# Altium schematic sheet Power Supply.SchDoc: =DocumentName
size A4; DocumentName: Power Supply
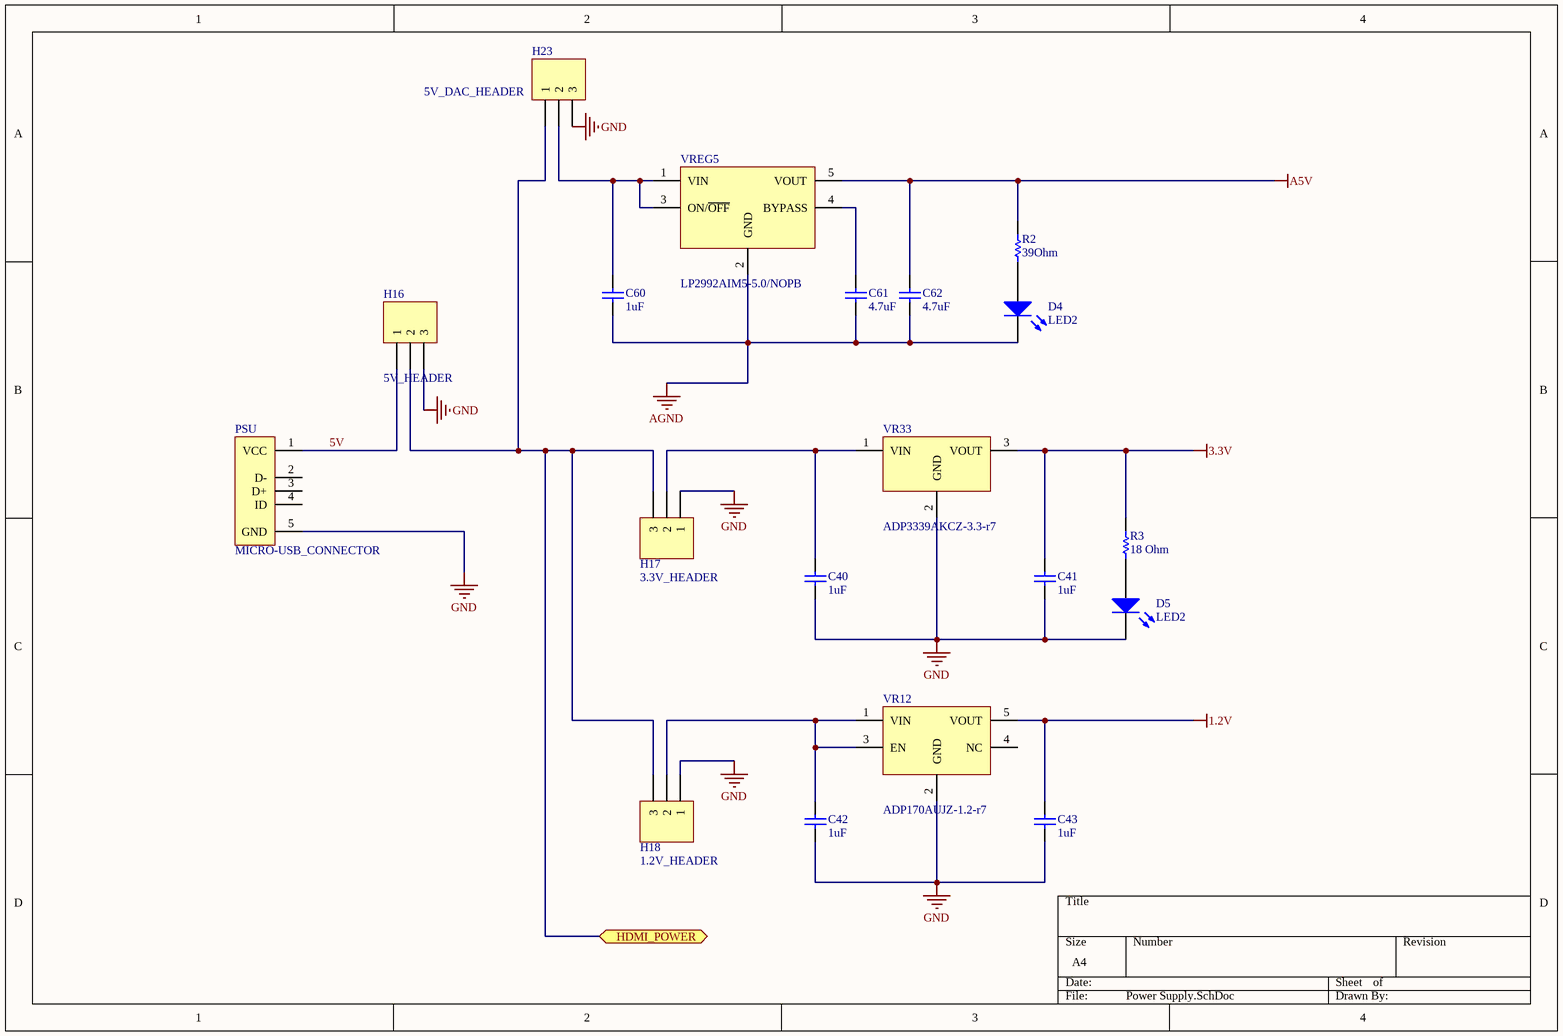
[diagram p0: Power Supply.SchDoc]

## Parts
C40  1uF  [CAPC0603(1608)100_M]
C41  1uF  [CAPC0603(1608)100_M]
C42  1uF  [CAPC0603(1608)100_M]
C43  1uF  [CAPC0603(1608)100_M]
C60  1uF  [CAPC0603(1608)100_M]
C61  4.7uF  [CAPC0603(1608)100_M]
C62  4.7uF  [CAPC0603(1608)100_M]
D4  LED2  [3.2X1.6X1.1]
D5  LED2  [3.2X1.6X1.1]
H16  5V_HEADER  [HDR1X3]
H17  3.3V_HEADER  [HDR1X3]
H18  1.2V_HEADER  [HDR1X3]
H23  5V_DAC_HEADER  [HDR1X3]
PSU  MICRO-USB_CONNECTOR  [MICRO-USB]
R2  39Ohm  [RESC0603(1608)_M]
R3  18 Ohm  [RESC0603(1608)_M]
VR12  ADP170AUJZ-1.2-r7  [VREG-1.2]
VR33  ADP3339AKCZ-3.3-r7  [VREG-3.3]
VREG5  LP2992AIM5-5.0/NOPB  [VREG-5]

## Ports
HDMI_POWER

## Nets
1.2V: C43.2 VR12.5(VOUT)
3.3V: C41.2 R3.2 VR33.3(VOUT)
A5V: C62.2 R2.2 VREG5.5(VOUT)
AGND: C60.1 C61.1 C62.1 D4.2(K) VREG5.2(GND)
GND: C40.1 C41.1 C42.1 C43.1 D5.2(K) H16.3 H17.1 H18.1 H23.3 PSU.5(GND) VR12.2(GND) VR33.2(GND)
5V: H16.1 PSU.1(VCC)
HDMI_POWER: H16.2 H17.3 H18.3 H23.1 ; port HDMI_POWER
NetC40_2: C40.2 H17.2 VR33.1(VIN)
NetC42_2: C42.2 H18.2 VR12.1(VIN) VR12.3(EN)
NetC60_2: C60.2 H23.2 VREG5.1(VIN) VREG5.3(ON/~{OFF})
NetC61_2: C61.2 VREG5.4(BYPASS)
NetD4_1: D4.1(A) R2.1
NetD5_1: D5.1(A) R3.1

Not connected (* = marked no-connect by the designer): PSU 2(D-) 3(D+) 4(ID); VR12 4(NC)

## Library data of the parts
C40-C43 C60-C62 = CMP-1035-00001-1: CAP 0.5pF 10V Â±0.1pF 0603 (1608 Metric) Thickness 1mm SMD; Case-EIA: 0603; Case-Metric: 1608; Max Thickness: 1 mm; Tolerance: Â±0.1pF; Technology: SMT; Rated Voltage: 10 V
  C40-C43 C60: Value: 1uF
  C61 C62: Value: 4.7uF
D4 D5 = LED2: Typical RED, GREEN, YELLOW, AMBER GaAs LED; Published: 8-Jun-2000; LatestRevisionDate: 17-Jul-2002; LatestRevisionNote: Re-released for DXP Platform.; PackageVersion: Feb-2002; PackageReference: 3.2X1.6X1.1; Publisher: Altium Limited; PackageDescription: SM LED; 2 Flat Leads
H16-H18 H23 = Header 3: Header, 3-Pin; LatestRevisionDate: 17-Jul-2002; LatestRevisionNote: Re-released for DXP Platform.; Publisher: Altium Limited
R2 R3 = CMP-1012-00002-1: 1R 0.1W 5% 0603 (1608 Metric)  SMD; Case-Metric: 1608; Case-EIA: 0603; Power: 0.1 W; Technology: SMT; Tolerance: 5 %
  R2: Value: 39Ohm
  R3: Value: 18 Ohm
VR33 = ADP3339AKCZ-3.3-r7: pin to pad: 1>3 2>1 3>2